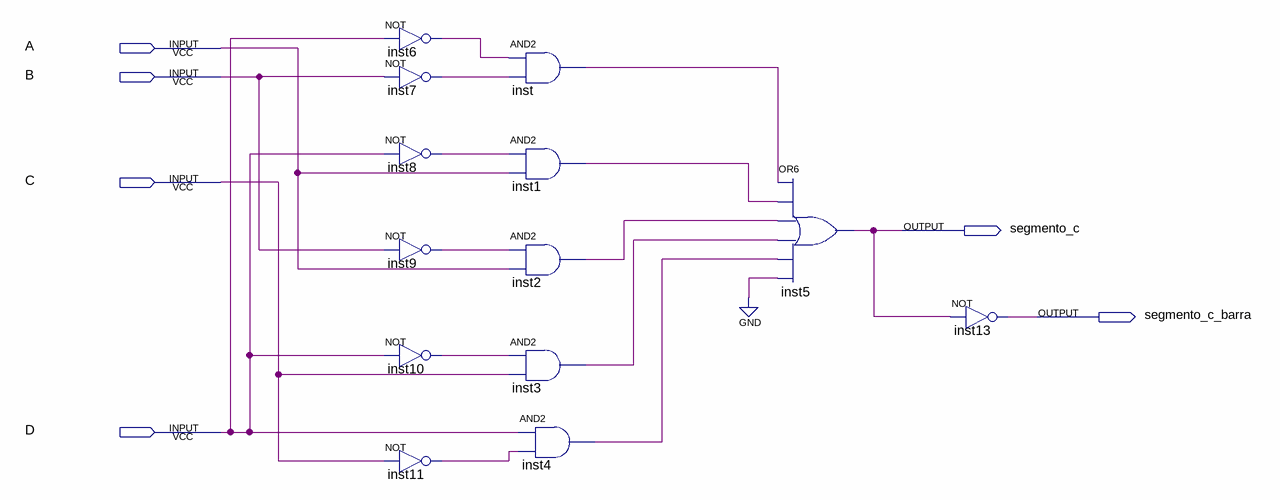
[diagram p0: schematic sheet]
// Quartus schematic segmento_c.bdf as structural Verilog: 13 symbols, 6 pins
module segmento_c (
  input  A,
  input  B,
  input  C,
  input  D,
  output segmento_c,
  output segmento_c_barra
);

  wire inst1_out, inst2_out, inst3_out, inst4_out, inst6_out, inst7_out, inst8_out, inst9_out, inst10_out,
       inst11_out, inst_out;

  not inst6 (inst6_out, D);
  not inst7 (inst7_out, B);
  not inst8 (inst8_out, D);
  not inst9 (inst9_out, B);
  not inst10 (inst10_out, D);
  not inst11 (inst11_out, C);
  and inst (inst_out, inst6_out, inst7_out);
  and inst1 (inst1_out, inst8_out, A);
  and inst2 (inst2_out, inst9_out, A);
  and inst3 (inst3_out, inst10_out, C);
  and inst4 (inst4_out, D, inst11_out);
  or inst5 (segmento_c, inst_out, inst1_out, inst2_out, inst3_out, inst4_out, 1'b0);
  not inst13 (segmento_c_barra, segmento_c);
endmodule
